# EAGLE design slave-v10 (EAGLE 6.5.0)
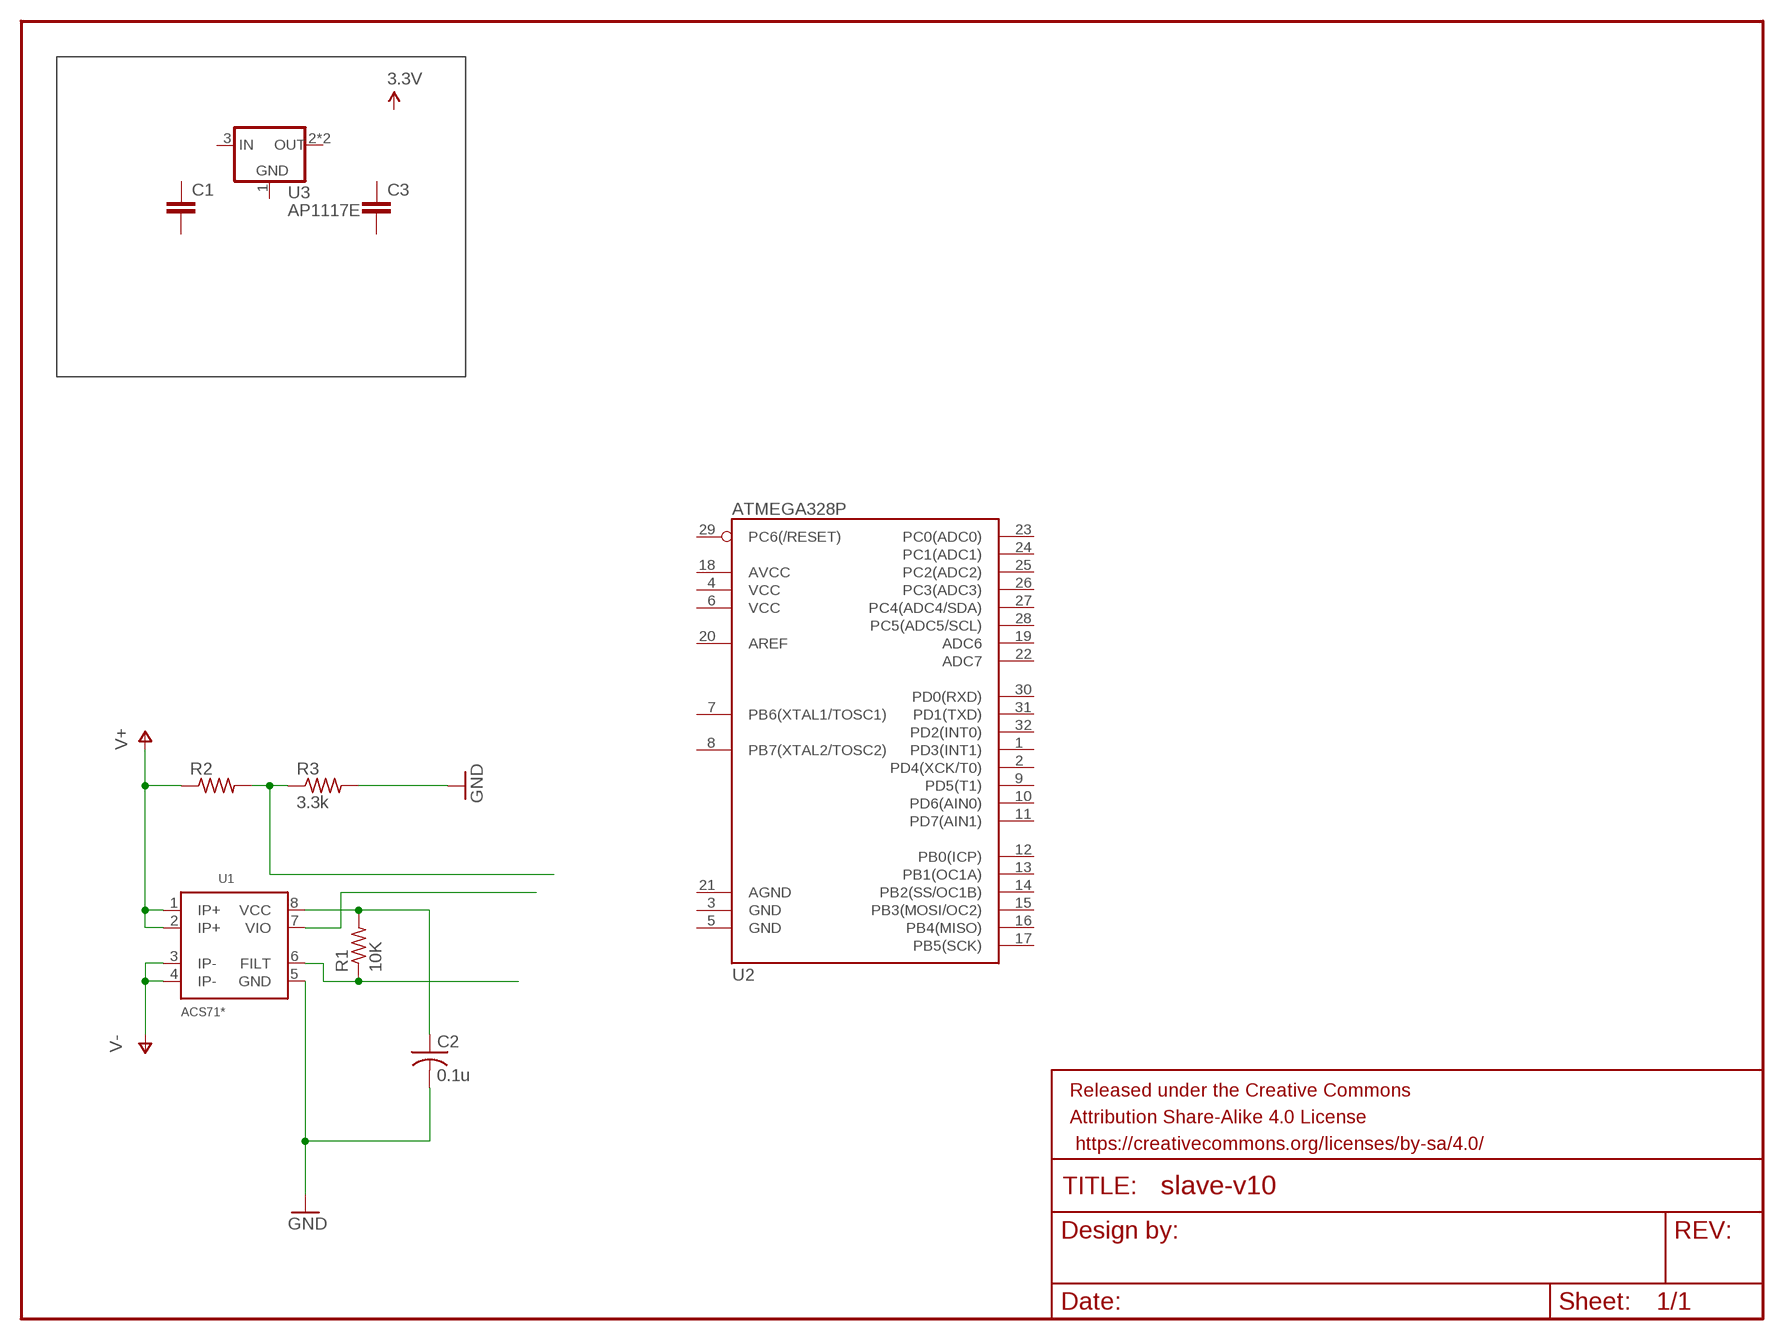
[diagram p0: schematic, sheet 1]

## Parts
C1  CAP0805  [0805]
C2  0.1u  C-USC0603  [C0603]
C3  CAP0805  [0805]
FRAME1  FRAME-LETTER  [CREATIVE_COMMONS]
R1  10K  R-US_R0603  [R0603]
R2  10k  R-US_R0603  [R0603]
R3  3.3k  R-US_R0603  [R0603]
U1  ACS71*  ACS715  [SO08]
U2  ATMEGA328P  ATMEGA328_SMT  [TQFP32-08]
U3  AP1117E  [SOT223]

## Nets
5V: C2.1 R1.2 U1.8(VCC)
GND: C2.2 R3.2 U1.5(GND)
N$1: U1.7(VIO)
N$5: R1.1 U1.6(FILT)
V+: R2.1 U1.1(IP+) U1.2(IP+)
V-: U1.3(IP-) U1.4(IP-)
VSENSE: R2.2 R3.1
Unconnected: C1.1 C1.2 C3.1 C3.2 U2.1(PD3(INT1)) U2.2(PD4(XCK/T0)) U2.3(GND) U2.4(VCC) U2.5(GND) U2.6(VCC) U2.7(PB6(XTAL1/TOSC1)) U2.8(PB7(XTAL2/TOSC2)) U2.9(PD5(T1)) U2.10(PD6(AIN0)) U2.11(PD7(AIN1)) U2.12(PB0(ICP)) U2.13(PB1(OC1A)) U2.14(PB2(SS/OC1B)) U2.15(PB3(MOSI/OC2)) U2.16(PB4(MISO)) U2.17(PB5(SCK)) U2.18(AVCC) U2.19(ADC6) U2.20(AREF) U2.21(AGND) U2.22(ADC7) U2.23(PC0(ADC0)) U2.24(PC1(ADC1)) U2.25(PC2(ADC2)) U2.26(PC3(ADC3)) U2.27(PC4(ADC4/SDA)) U2.28(PC5(ADC5/SCL)) U2.29(PC6(/RESET)) U2.30(PD0(RXD)) U2.31(PD1(TXD)) U2.32(PD2(INT0)) U3.1(GND) U3.2(OUT) U3.3(IN) U3.4(OUT)

## Library data of the parts
C1 C3 = SparkFun-Passives:CAP: Capacitor Standard 0603 ceramic capacitor, and 0.1" leaded capacitor.
C2 = resistor:C-US: CAPACITOR, American symbol; PARTNO: CC0603MRY5V9BB104
FRAME1 = SparkFun-Aesthetics:FRAME-LETTER: Schematic Frame Standard 8.5x11 US Letter frame
R1 R3 = resistor:R-US_: RESISTOR, American symbol; PARTNO: RMCF0603FT10K0
R2 = resistor:R-US_: RESISTOR, American symbol; PARTNO: ERJ-3EKF3302V
U1 = allegro3:ACS71; PARTNO: ACS715ELCTR-20A-T
U2 = SparkFun-DigitalIC:ATMEGA328_SMT: 32-Pin Atmega328 part Commonly used on Arduino compatible boards Available in QFP and QFN packages TQFP is IC-09069 QFN is non-stock; PROD_ID: IC-09069
U3 = v-reg:AP1117: LDO Regulator

## Board
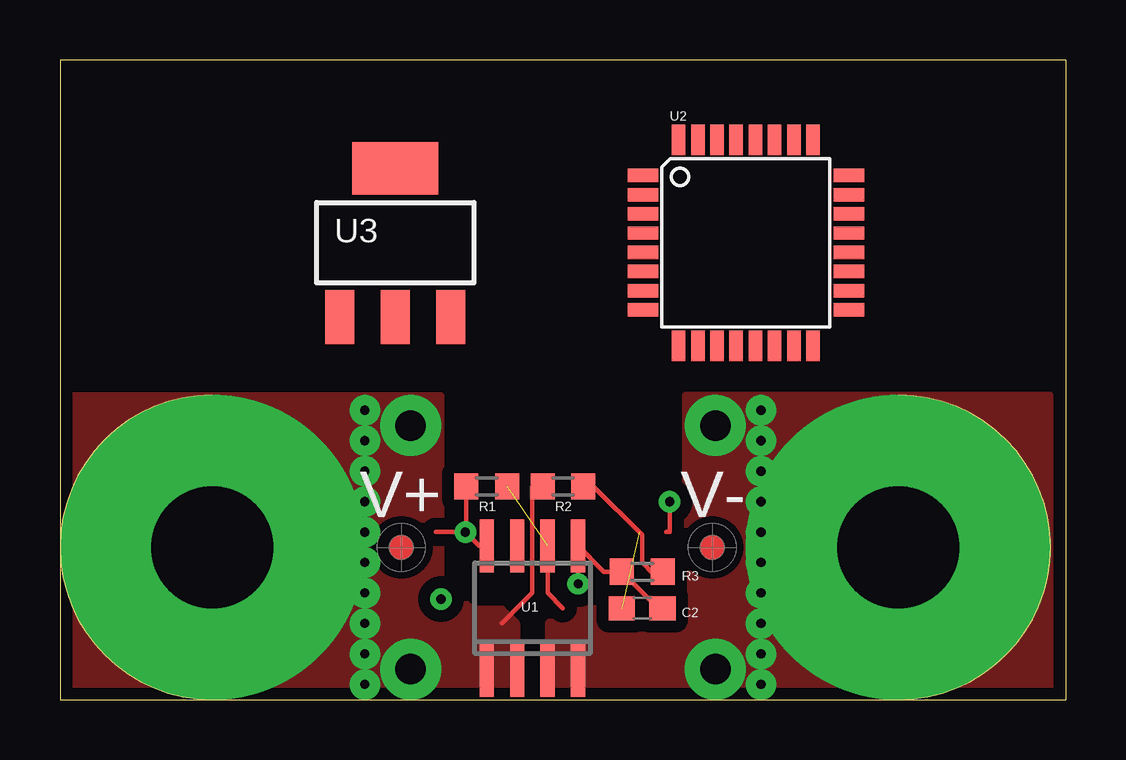
[diagram p1: board, top side]
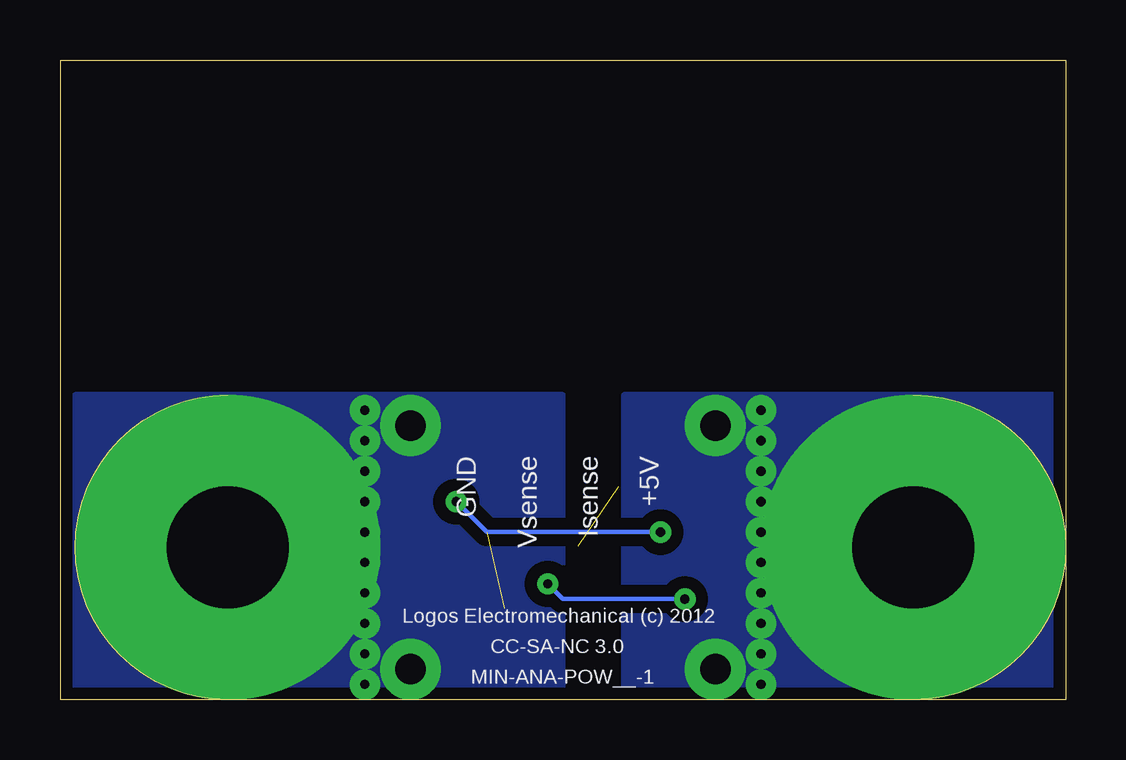
[diagram p2: board, bottom side, seen from below]

Size 41.91 x 26.67 mm. Coordinates in mm from the lower left corner, seen from the top.
Outline: 0,0 41.91,0 41.91,26.67 0,26.67 0,0
Copper layers (1*16): Top 0.0356mm / dielectric 1.5011mm / Bottom 0.0356mm
Design rules "default": minimum track width 7mil, minimum drill 15mil, track to track 7mil, track to pad 7mil, pad to pad 7mil, via to via 7mil, smd to smd 0mil, copper to edge 10mil, drill to drill 8mil, minimum pad ring 12mil, minimum via ring 10mil, stop-mask expansion 0mil, vias tented up to drill 50mil, thermal gap 10mil
Milling: 2 lines

### Footprints (pad centres in the part's own frame; a part is rotated, then mirrored left to right if it is on the bottom)
0805 = smd 0.8 x 1.2: 1 -0.9,0; 2 0.9,0
C0603 = smd 1.1 x 1: 1 -0.85,0; 2 0.85,0
R0603 = smd 1 x 1.1: 1 -0.85,0; 2 0.85,0
SO08 = smd 0.6 x 2.2: 1 -1.905,-2.6; 2 -0.635,-2.6; 3 0.635,-2.6; 4 1.905,-2.6; 5 1.905,2.6; 6 0.635,2.6; 7 -0.635,2.6; 8 -1.905,2.6
TQFP32-08 = smd 1.27 x 0.559: 1 -4.293,2.8; 2 -4.293,2; 3 -4.293,1.2; 4 -4.293,0.4; 5 -4.293,-0.4; 6 -4.293,-1.2; 7 -4.293,-2; 8 -4.293,-2.8; 17 4.293,-2.8; 18 4.293,-2; 19 4.293,-1.2; 20 4.293,-0.4; 21 4.293,0.4; 22 4.293,1.2; 23 4.293,2; 24 4.293,2.8 | smd 0.559 x 1.27: 9 -2.8,-4.293; 10 -2,-4.293; 11 -1.2,-4.293; 12 -0.4,-4.293; 13 0.4,-4.293; 14 1.2,-4.293; 15 2,-4.293; 16 2.8,-4.293; 25 2.8,4.293; 26 2,4.293; 27 1.2,4.293; 28 0.4,4.293; 29 -0.4,4.293; 30 -1.2,4.293; 31 -2,4.293; 32 -2.8,4.293
SOT223 = smd 1.219 x 2.235: 1 -2.311,-3.099; 2 0,-3.099; 3 2.311,-3.099 | smd 3.6 x 2.2: 4 0,3.099

### Placement (x,y rotation side)
C1  -8.89,-7.62 0 top  (outside the outline)
C2  24.26,3.81 0 top
C3  -12.7,-7.62 0 top  (outside the outline)
FRAME1  13.97,-8.89 0 top  (outside the outline)
R1  17.78,8.89 180 top
R2  20.95,8.89 0 top
R3  24.26,5.33 180 top
U1  19.68,3.81 0 top
U2  28.57,19.05 0 top
U3  13.97,19.05 0 top
U$1  [FIDUCIAL_G10]  14.22,6.35 0 top
U$2  [FIDUCIAL_G10]  27.18,6.35 0 top

### Tracks (layer width: path | path; a pad name or v marks a point on that pad's centre or on a via)
5V  (via drill 0.38)  (1 unrouted)
  Top 0.178: v25.4,8.26 25.4,6.99 25.25,6.99 | 15.66,6.99 v16.89,6.99 | U1.8 17.47,6.41 v16.89,6.99 | v16.89,6.99 16.93,7.02 R1.2
  Bottom 0.178: v16.89,6.99 24.13,6.99 v25.4,8.26
GND  (via drill 0.38)
  Top 0.178: 23.31,5.43 R3.2 | C2.2 24.93,3.81 R3.2 | v21.59,4.83 U1.5 22.67,5.33 R3.2
  Bottom 0.178: v15.88,4.19 20.95,4.19 v21.59,4.83
N$5  (1 unrouted)
  Top 0.178: U1.6 20.32,4.45 20.95,3.81
V+  (via drill 0.38 pad 1.27, 1.27 pad 2.54, 5.08 pad 12.7)
  Top 0.178: R2.1 20.11,8.68 19.68,8.89 19.68,4.45 18.41,3.17
  Top 0.254: v6.35,6.35 6.35,8.89
  other vias: 14.61,11.43 14.61,1.27 12.7,12.06 12.7,10.79 12.7,9.53 12.7,8.26 12.7,6.99 12.7,5.71 12.7,4.45 12.7,3.17 12.7,1.91 12.7,0.64
  pour Top (isolate 0.508, no thermals): 0,12.7 15.88,12.7 15.88,5.08 17.14,3.81 18.41,3.81 19.05,3.17 19.05,0 0,0
  pour Bottom (isolate 0.508): 0,12.7 18.41,12.7 18.41,0 0,0
V-  (via drill 0.38 pad 1.27, 1.27 pad 2.54, 5.08 pad 12.7)
  other vias: 34.92,6.35 27.3,11.43 27.3,1.27 29.21,12.06 29.21,10.79 29.21,9.53 29.21,8.26 29.21,6.99 29.21,5.71 29.21,4.45 29.21,3.17 29.21,1.91 29.21,0.64
  pour Top (isolate 0.508, no thermals): 41.27,12.7 26.04,12.7 26.04,5.08 24.77,3.81 20.95,3.81 20.32,3.17 20.32,0 41.27,0
  pour Bottom (isolate 0.508): 20.95,12.7 41.27,12.7 41.27,0 20.95,0
VSENSE
  Top 0.178: R3.1 24.73,5.25 24.26,5.71 24.26,6.86 22.23,8.89 R2.2 22.23,9.31

### Text on the board
tNames: V+ | V-
bNames: +5V | Isense | Vsense | GND | Logos Electromechanical (c) 2012 | CC-SA-NC 3.0 | MIN-ANA-POW__-1